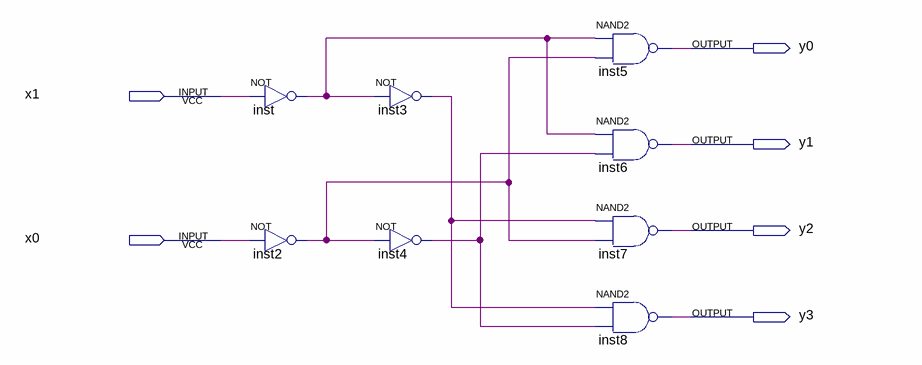
[diagram p0: schematic sheet]
// Quartus schematic 1.bdf as structural Verilog: 8 symbols, 6 pins
module \1  (
  input  x1,
  input  x0,
  output y0,
  output y1,
  output y2,
  output y3
);

  wire inst2_out, inst3_out, inst4_out, inst_out;

  not inst (inst_out, x1);
  not inst2 (inst2_out, x0);
  not inst3 (inst3_out, inst_out);
  not inst4 (inst4_out, inst2_out);
  nand inst5 (y0, inst_out, inst2_out);
  nand inst6 (y1, inst_out, inst4_out);
  nand inst7 (y2, inst3_out, inst2_out);
  nand inst8 (y3, inst3_out, inst4_out);
endmodule
